# EAGLE design solr (EAGLE 8.2.1)
PROJECT_AUTHOR: tinkerman.cat <xose.perez@gmail.com>; PROJECT_LICENSE: CC-BY-SA 3.0; PROJECT_NAME: SOLR; PROJECT_VERSION: 2.1.20170611
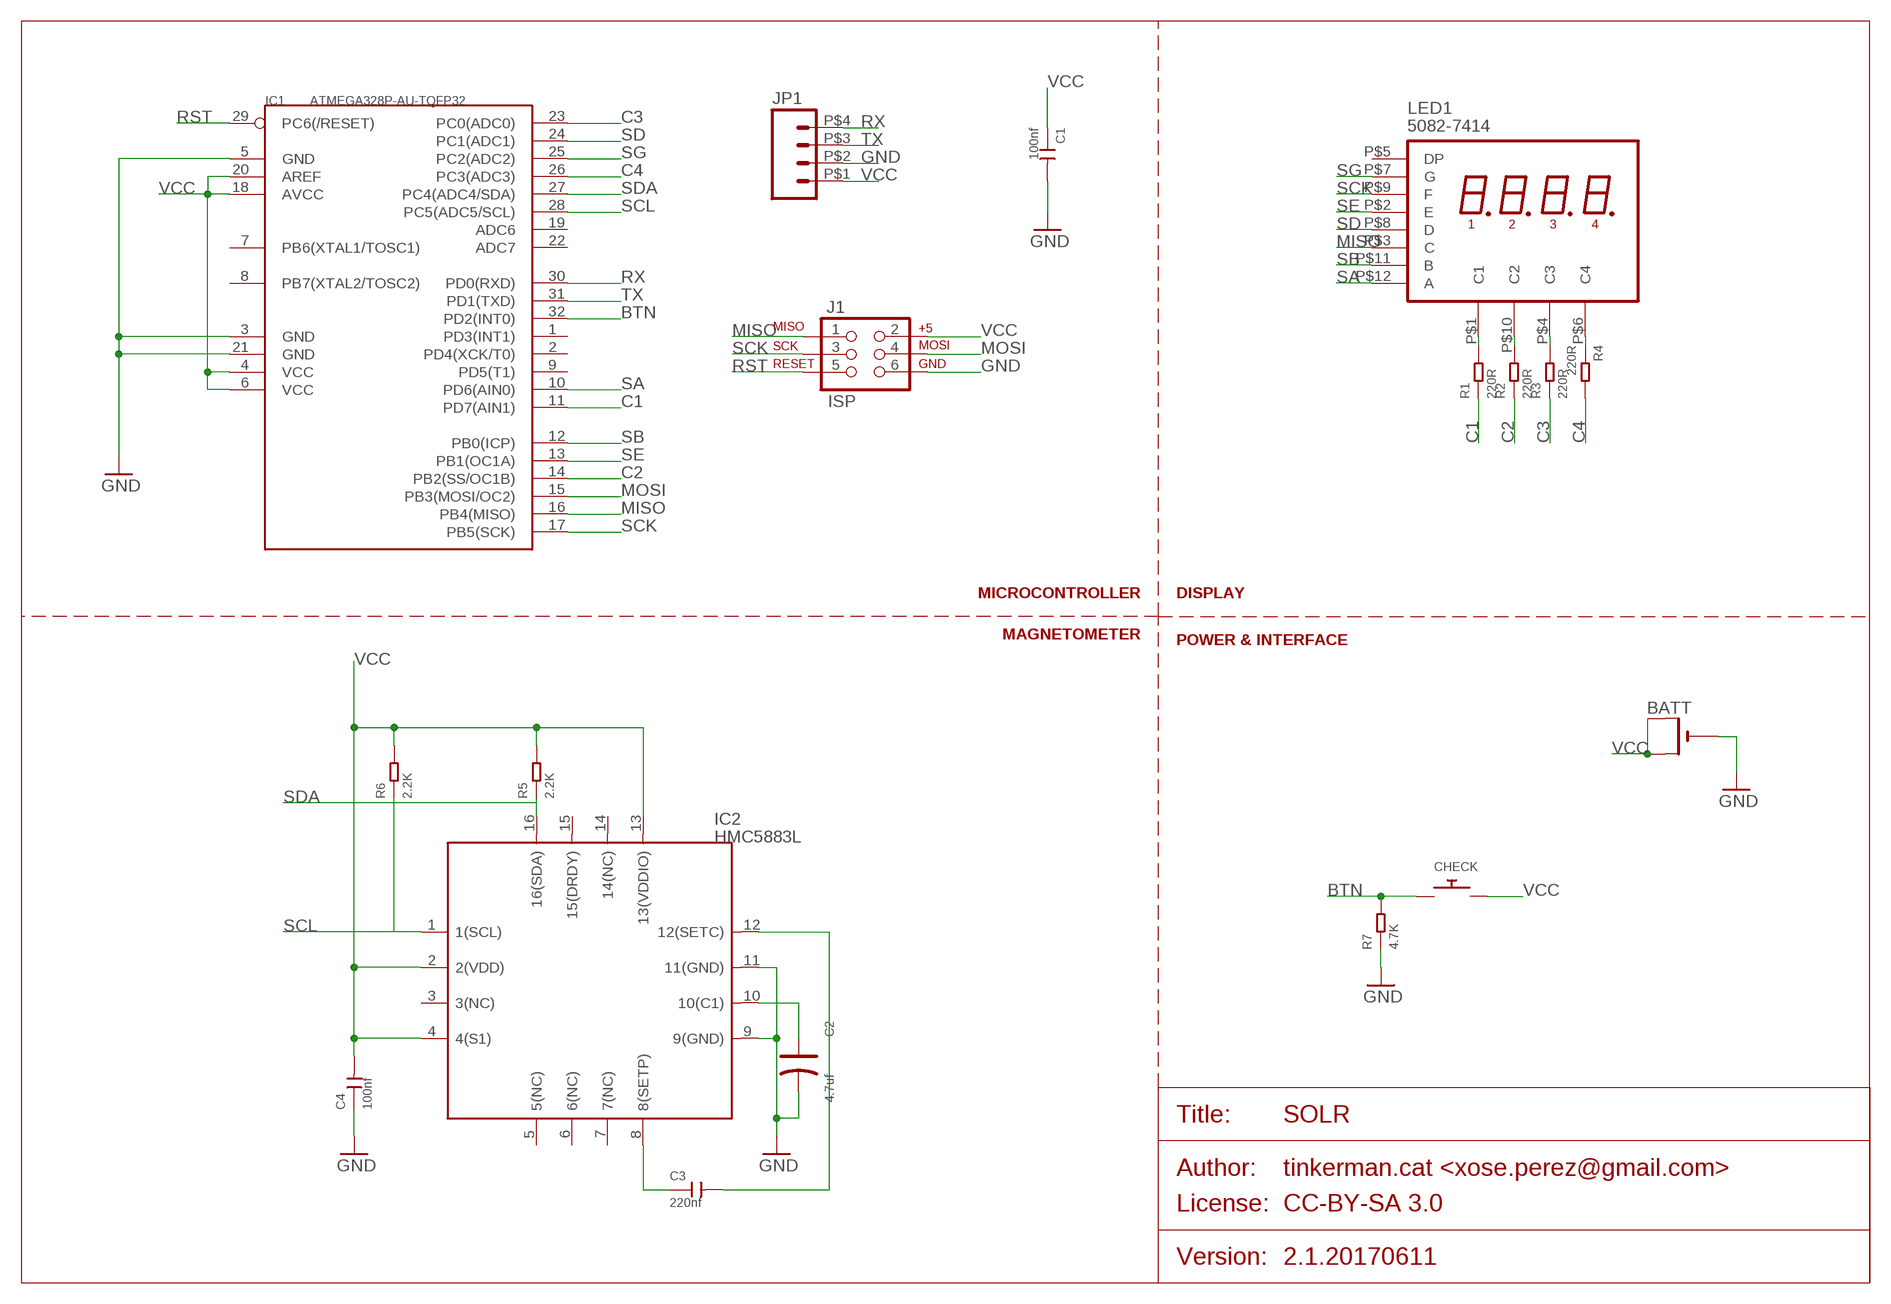
[diagram p0: schematic, sheet 1]

## Parts
BATT  CR2032SMT  [CR2032-SMD]
C1  100nf  CERAMIC-100NF-50V-10%-X7R(0805)  [C0805]
C2  4.7uf  TANTALUM-SMD-4.7UF-16V(AVX-A)  [AVX-A]
C3  220nf  CERAMIC-100NF-50V-10%-X7R(0805)  [C0805]
C4  100nf  CERAMIC-100NF-50V-10%-X7R(0805)  [C0805]
CHECK  SWITCH_PUSHBUTTONC&K_KSS  [BTN_CK_KSS]
IC1  ATMEGA328P-AU-TQFP32  MCU-ATMEGA328P-AU(TQFP32)  [TQFP32-0.8-7X7MM]
IC2  HMC5883L  MAGNETIC-HMC5883L(PLCC16)  [PLCC16-0.5-3X3MM]
J1  ISP  AVR_SPIEDGE  [2X3EDGE]
JP1  M04SMD_ROUND_PADS  [1X04_SMD_ROUND_PADS]
LED1  5082-7414  [5082-7414]
R1  220R  SMD-RES-220R-5%-1/8W(0805)  [R0805]
R2  220R  SMD-RES-220R-5%-1/8W(0805)  [R0805]
R3  220R  SMD-RES-220R-5%-1/8W(0805)  [R0805]
R4  220R  SMD-RES-220R-5%-1/8W(0805)  [R0805]
R5  2.2K  SMD-RES-2.2K-5%-1/8W(0805)  [R0805]
R6  2.2K  SMD-RES-2.2K-5%-1/8W(0805)  [R0805]
R7  4.7K  SMD-RES-4.7K-5%-1/8W(0805)  [R0805]

## Nets
BTN: CHECK.P$1 IC1.32(PD2(INT0)) R7.2
C1: IC1.11(PD7(AIN1)) R1.1
C2: IC1.14(PB2(SS/OC1B)) R2.1
C3: IC1.23(PC0(ADC0)) R3.1
C4: IC1.26(PC3(ADC3)) R4.2
GND: BATT.- C1.2 C2.- C4.1 IC1.3(GND) IC1.5(GND) IC1.21(GND) IC2.9(9(GND)) IC2.11(11(GND)) J1.6 JP1.P$2 R7.1
MISO: IC1.16(PB4(MISO)) J1.1 LED1.P$3(C)
MOSI: IC1.15(PB3(MOSI/OC2)) J1.4
N$1: LED1.P$1(C1) R1.2
N$2: C3.1 IC2.8(8(SETP))
N$3: LED1.P$10(C2) R2.2
N$4: LED1.P$4(C3) R3.2
N$5: LED1.P$6(C4) R4.1
N$7: C3.2 IC2.12(12(SETC))
N$10: C2.+ IC2.10(10(C1))
RST: IC1.29(PC6(/RESET)) J1.5
RX: IC1.30(PD0(RXD)) JP1.P$4
SA: IC1.10(PD6(AIN0)) LED1.P$12(A)
SB: IC1.12(PB0(ICP)) LED1.P$11(B)
SCK: IC1.17(PB5(SCK)) J1.3 LED1.P$9(F)
SCL: IC1.28(PC5(ADC5/SCL)) IC2.1(1(SCL)) R6.1
SD: IC1.24(PC1(ADC1)) LED1.P$8(D)
SDA: IC1.27(PC4(ADC4/SDA)) IC2.16(16(SDA)) R5.1
SE: IC1.13(PB1(OC1A)) LED1.P$2(E)
SG: IC1.25(PC2(ADC2)) LED1.P$7(G)
TX: IC1.31(PD1(TXD)) JP1.P$3
VCC: BATT.+$1(+) BATT.+$2(+1) C1.1 C4.2 CHECK.P$2 IC1.4(VCC) IC1.6(VCC) IC1.18(AVCC) IC1.20(AREF) IC2.2(2(VDD)) IC2.4(4(S1)) IC2.13(13(VDDIO)) J1.2 JP1.P$1 R5.2 R6.2
Unconnected: IC1.1(PD3(INT1)) IC1.2(PD4(XCK/T0)) IC1.7(PB6(XTAL1/TOSC1)) IC1.8(PB7(XTAL2/TOSC2)) IC1.9(PD5(T1)) IC1.19(ADC6) IC1.22(ADC7) IC2.3(3(NC)) IC2.5(5(NC)) IC2.6(6(NC)) IC2.7(7(NC)) IC2.14(14(NC)) IC2.15(15(DRDY)) LED1.P$5(DP)

## Notes on the sheet
- MICROCONTROLLER | DISPLAY
- MAGNETOMETER | POWER & INTERFACE

## Library data of the parts
BATT = xose:CR2032
C1 C4 = Seeed-Capacitor-2016:CERAMIC-100NF-50V-10%-X7R(0805): 302010165; MPN: CC0805KRX7R9BB104
C2 = Seeed-Capacitor-2016:TANTALUM-SMD-4.7UF-16V(AVX-A): 302020006; MPN: TAJA475*016#NJ
C3 = Seeed-Capacitor-2016:CERAMIC-100NF-50V-10%-X7R(0805): 302010165; MPN: CC0805KRX7R9BB104; VALUE: 100nf
CHECK = adafruit:SWITCH_PUSHBUTTON: Buttons SOFTTOUCHSMD_SJ - Soft touch temporary push button (Super Junk Akihabara) Compatible with SKPMANE010 [Mouser: 688-SKPMAN] C&K_KSS = Digikey: KSS221GLFS
IC1 = Seeed-IC-2016:MCU-ATMEGA328P-AU(TQFP32): 310010049; MPN: ATMEGA328P-AU
IC2 = Seeed-Sensor-2016:MAGNETIC-HMC5883L(PLCC16): 314040002; MPN: HMC5883L
J1 = xose:AVR_SPI: AVR ISP 6 Pin This is the reduced ISP connector for AVR programming. Common on Arduino. This footprint will take up less PCB space and can be used with a 10-pin to 6-pin adapter such as SKU: BOB-08508
JP1 = xose:M04: Header 4 Standard 4-pin 0.1" header. Use with straight break away headers (SKU : PRT-00116), right angle break away headers (PRT-00553), swiss pins (PRT-00743), machine pins (PRT-00117), and female headers (PRT-00115). Molex polarized connector foot print use with SKU : PRT-08231 with associated crimp pins and housings. 1MM SMD Version SKU: PRT-10208
LED1 = xose:5082-7414: 4 digits X 7-segment + DP LED display
R1-R4 = Seeed-Resistor-2016:SMD-RES-220R-5%-1/8W(0805): 301010315; MPN: RC0805JR-07220RL
R5 R6 = Seeed-Resistor-2016:SMD-RES-2.2K-5%-1/8W(0805): 301010333; MPN: RC0805JR-072K2L
R7 = Seeed-Resistor-2016:SMD-RES-4.7K-5%-1/8W(0805): 301010306; MPN: RC0805JR-074K7L

## Board
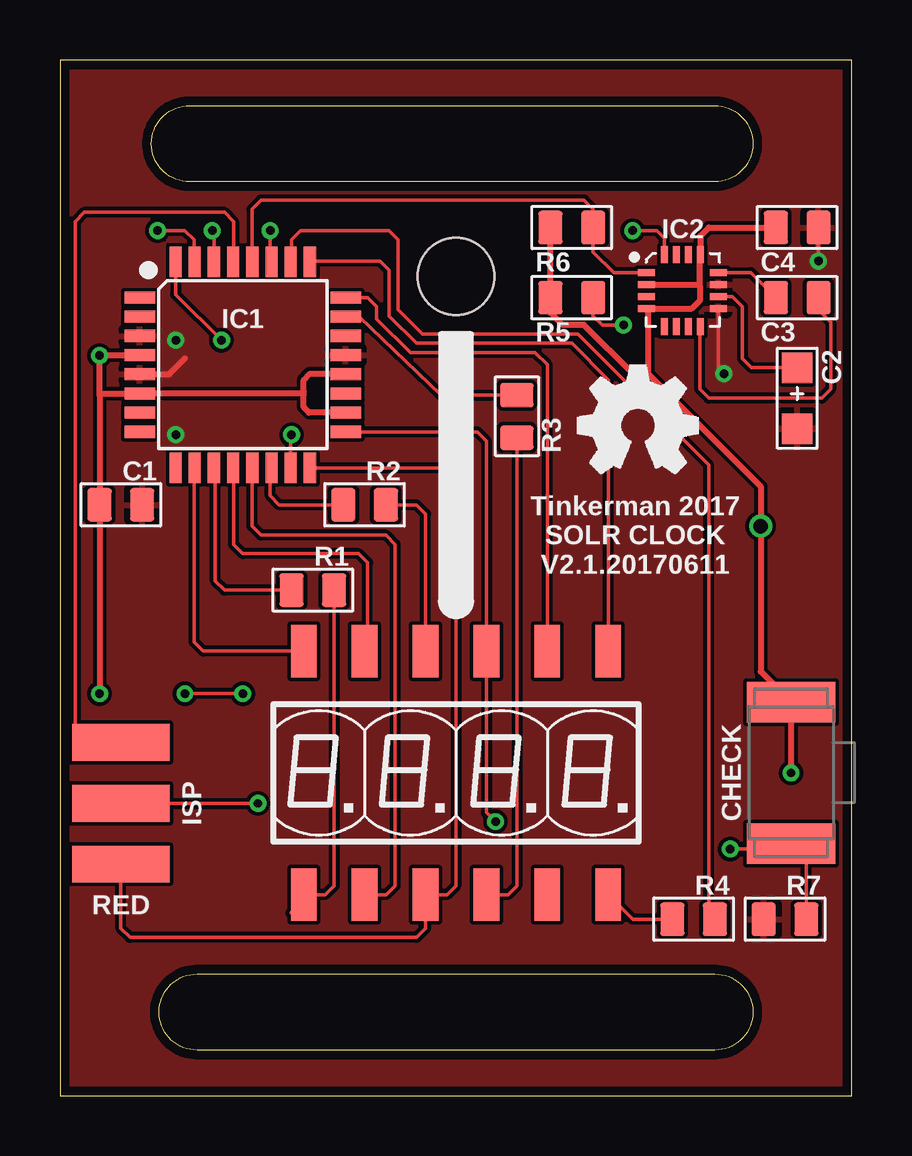
[diagram p1: board, top side]
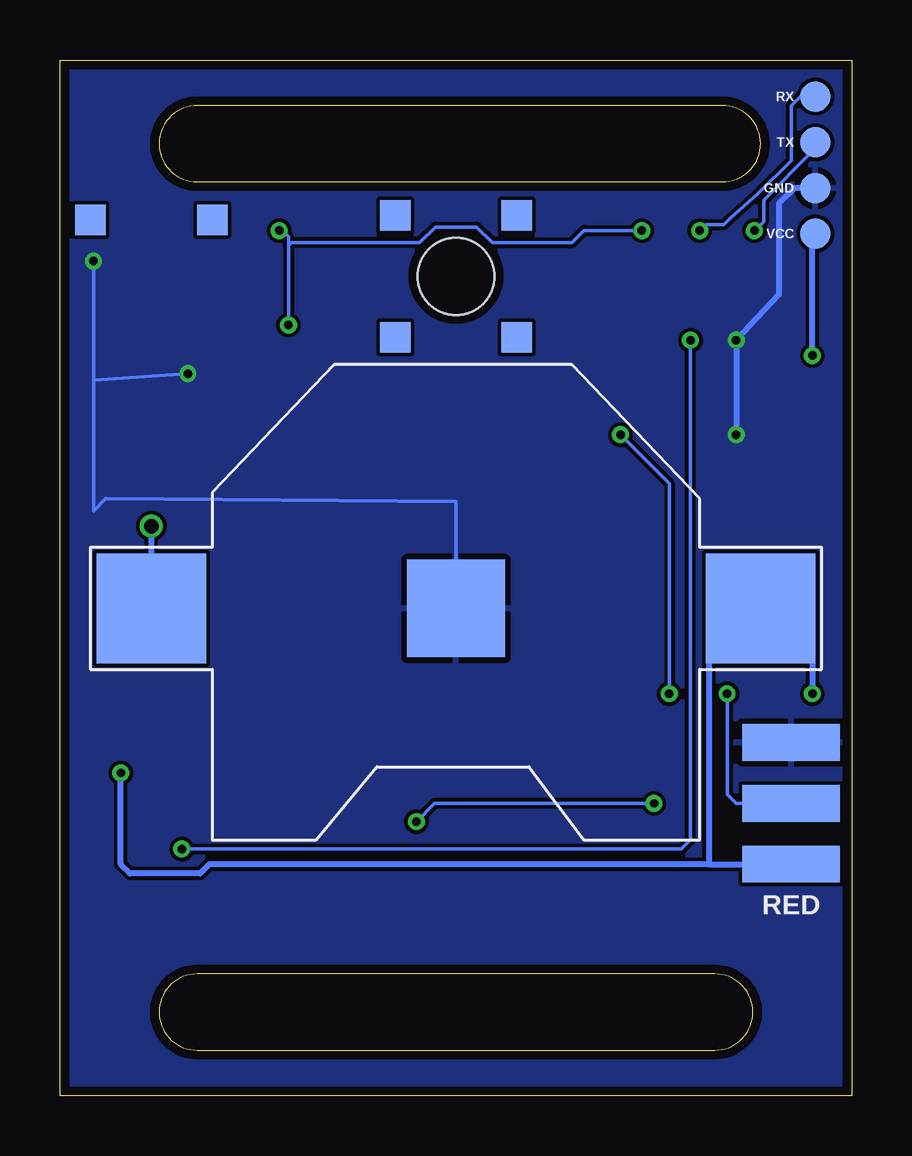
[diagram p2: board, bottom side, seen from below]

Size 33.02 x 43.18 mm. Coordinates in mm from the lower left corner, seen from the top.
Outline: 0,0 33.02,0 33.02,43.18 0,43.18 0,0
Outline: 5.4,41.27 27.3,41.27 arc-90 28.89,39.69 arc-90 27.3,38.1 5.4,38.1 arc-90 3.81,39.69 arc-90 5.4,41.27
Outline: 5.71,5.08 27.3,5.08 arc-90 28.89,3.49 arc-90 27.3,1.91 5.71,1.91 arc-90 4.13,3.49 arc-90 5.71,5.08
Copper layers (1*16): Top 0.0356mm / dielectric 1.5011mm / Bottom 0.0356mm
Design rules "oshpark-2layer": minimum track width 6mil, minimum drill 13mil, track to track 6mil, track to pad 6mil, pad to pad 6mil, via to via 6mil, smd to smd 6mil, copper to edge 15mil, drill to drill 6mil, minimum pad ring 7mil, minimum via ring 7mil, stop-mask expansion 2.5mil, vias tented up to drill 0mil, thermal gap 10mil
Holes 3.2 mm at 16.51,34.16

### Footprints (pad centres in the part's own frame; a part is rotated, then mirrored left to right if it is on the bottom)
CR2032-SMD = smd 4.572 x 4.572: +$1 -12.7,0; +$2 12.7,0 | smd 4.064 x 4.064: - 0,0
C0805 = smd 1.397 x 1.016: 1 0,0.889; 2 0,-0.889
AVX-A = smd 1.27 x 1.27: + -1.27,0; - 1.27,0
BTN_CK_KSS = smd 1.7 x 3.7: P$1 -2.95,0; P$2 2.95,0
TQFP32-0.8-7X7MM = smd 1.27 x 0.508: 1 -4.293,2.8; 2 -4.293,2; 3 -4.293,1.2; 4 -4.293,0.4; 5 -4.293,-0.4; 6 -4.293,-1.2; 7 -4.293,-2; 8 -4.293,-2.8; 17 4.293,-2.8; 18 4.293,-2; 19 4.293,-1.2; 20 4.293,-0.4; 21 4.293,0.4; 22 4.293,1.2; 23 4.293,2; 24 4.293,2.8 | smd 0.508 x 1.27: 9 -2.8,-4.293; 10 -2,-4.293; 11 -1.2,-4.293; 12 -0.4,-4.293; 13 0.4,-4.293; 14 1.2,-4.293; 15 2,-4.293; 16 2.8,-4.293; 25 2.8,4.293; 26 2,4.293; 27 1.2,4.293; 28 0.4,4.293; 29 -0.4,4.293; 30 -1.2,4.293; 31 -2,4.293; 32 -2.8,4.293
PLCC16-0.5-3X3MM = smd 0.7 x 0.3: 1 0,2.25; 2 0,1.75; 3 0,1.25; 4 0,0.75; 9 3,0.75; 10 3,1.25; 11 3,1.75; 12 3,2.25 | smd 0.3 x 0.7: 5 0.75,0; 6 1.25,0; 7 1.75,0; 8 2.25,0; 13 2.25,3; 14 1.75,3; 15 1.25,3; 16 0.75,3
2X3EDGE = smd 1.524 x 4.064: 1 2.54,0; 3 0,0; 5 -2.54,0 | smd 1.524 x 4.064 bottom: 2 2.54,0; 4 0,0; 6 -2.54,0
1X04_SMD_ROUND_PADS = smd 1.27 x 1.27: P$1 0,0; P$2 1.905,0; P$3 3.81,0; P$4 5.715,0
5082-7414 = smd 1.067 x 2.184: P$1 0,-1.27; P$2 2.54,-1.27; P$3 5.08,-1.27; P$4 7.62,-1.27; P$5 10.16,-1.27; P$6 12.7,-1.27; P$7 12.7,8.89; P$8 10.16,8.89; P$9 7.62,8.89; P$10 5.08,8.89; P$11 2.54,8.89; P$12 0,8.89
R0805 = smd 1.397 x 1.016: 1 0,0.889; 2 0,-0.889
M3_WELDING_NUT_FLAT = smd 1.27 x 1.27: P$1 -2.54,2.54; P$2 2.54,2.54; P$3 2.54,-2.54; P$4 -2.54,-2.54
M3_WELDING_NUT_STAND = smd 1.27 x 1.27: P$1 -2.54,0; P$2 2.54,0

### Placement (x,y rotation side)
BATT  16.51,20.32 180 bottom
C1  2.54,24.64 90 top
C2  30.73,29.08 270 top
C3  30.73,33.27 270 top
C4  30.73,36.2 270 top
CHECK  30.48,13.46 90 top
IC1  7.62,30.48 0 top
IC2  24.45,32.07 0 top
J1  2.54,12.19 270 top
JP1  1.52,35.94 90 bottom
LED1  10.16,9.65 0 top
R1  10.54,21.08 90 top
R2  12.7,24.64 90 top
R3  19.05,28.32 0 top
R4  26.42,7.37 90 top
R5  21.34,33.27 270 top
R6  21.34,36.2 270 top
R7  30.23,7.37 90 top
U$1  M3_WELDING_NUTFLAT  [M3_WELDING_NUT_FLAT]  16.51,34.16 0 bottom
U$2  M3_WELDING_NUTSTAND  [M3_WELDING_NUT_STAND]  29.21,36.51 0 bottom

### Tracks (layer width: path | path; a pad name or v marks a point on that pad's centre or on a via)
BTN  (via drill 0.35)
  Top 0.152: 30.38,10.29 v27.94,10.29 | v6.73,31.5 4.82,33.41 IC1.32 | R7.2 31.11,9.88 CHECK.P$1
  Top 0.191: CHECK.P$1 30.38,10.29
  Bottom 0.152: v27.94,10.29 7.11,10.29 6.73,10.67 v6.73,31.5
C1
  Top 0.152: R1.1 6.86,21.08 6.48,21.46 6.48,26.13 IC1.11
C2
  Top 0.152: R2.1 9.14,24.64 8.76,25.02 8.76,26.13 IC1.14
C3
  Top 0.152: IC1.23 12.48,32.48 15.88,29.21 R3.1
C4
  Top 0.152: 27.05,7.74 27.05,26.29 21.59,31.75 15.11,31.75 14.1,32.77 14.1,35.69 13.72,36.07 10.03,36.07 9.65,35.69 9.65,34.8 IC1.26
  Top 0.191: R4.2 27.05,7.74
GND  (via drill 0.35)
  Top 0.152: C4.1 v31.62,34.8 | IC2.9 27.45,30.21 v27.69,30.1
  Top 0.254: IC1.5 4.55,30.08 5.21,30.73
  Bottom 0.152: 31.62,29.84 v31.62,34.8 | 31.62,29.84 31.62,24.38 31.11,24.89 16.51,24.77 BATT.- | v27.69,30.1 31.62,29.84
  Bottom 0.254: JP1.P$2 2.41,37.85 3.05,37.21 3.05,33.4 v4.83,31.5 v4.83,27.56
  pour Top: 0,43.18 0,0 33.02,0 33.02,43.18
  pour Bottom: -0.38,43.43 33.4,43.43 33.4,-0.51 -0.38,-0.51
MISO
  Top 0.152: J1.1 2.54,6.99 2.92,6.6 14.86,6.6 15.24,6.99 LED1.P$3 16.13,8.38 16.51,8.76 16.51,25.78 16.13,26.16 10.45,26.16 IC1.16
MOSI  (via drill 0.35)
  Top 0.152: v7.62,16.76 v5.21,16.76 | IC1.15 9.62,27.15 v9.65,27.56
  Bottom 0.152: v9.65,27.56 7.62,25.53 v7.62,16.76 | v5.21,16.76 5.21,12.57 4.83,12.19 J1.4
N$1
  Top 0.152: R1.2 11.43,8.76 11.05,8.38 LED1.P$1
  Top 0.191: 9.65,7.62 10.16,8.13 LED1.P$1
N$2
  Top 0.152: IC2.8 26.67,32.04 26.67,29.46 27.05,29.08 31.75,29.08 32.13,29.46 32.13,32.26 31.62,32.77 C3.1
N$3
  Top 0.152: LED1.P$10 15.24,24.26 14.86,24.64 R2.2
N$4
  Top 0.152: LED1.P$4 18.67,8.38 19.05,8.76 R3.2
  Top 0.191: LED1.P$4 17.78,9.27
N$5
  Top 0.152: R4.1 23.88,7.37 LED1.P$6
N$7
  Top 0.152: IC2.12 28.8,34.32 C3.2
N$10
  Top 0.152: IC2.10 28.02,33.32 28.45,32.89 28.45,30.73 28.83,30.35 C2.+
RST
  Top 0.152: 2.6,14.61 0.64,14.67 0.64,36.45 1.02,36.83 6.86,36.83 7.24,36.45 7.24,34.79 IC1.29
  Top 0.191: 2.6,14.61 J1.5
RX  (via drill 0.35)
  Top 0.152: IC1.30 6.42,36 v6.35,36.07
  Bottom 0.152: v6.35,36.07 6.1,36.32 5.33,36.32 5.08,36.58 3.94,37.59 2.54,38.99 2.54,41.27 2.16,41.66 JP1.P$4
SA
  Top 0.152: LED1.P$12 5.97,18.54 5.59,18.92 5.59,26.16 IC1.10
SB
  Top 0.152: 12.83,18.54 12.83,22.23 12.45,22.61 7.62,22.61 7.24,22.99 7.24,26.17 IC1.12
  Top 0.191: LED1.P$11 12.83,18.54
SCK  (via drill 0.35)
  Top 0.152: J1.3 v8.26,12.19 | IC1.17 17.41,27.68 17.78,27.3 LED1.P$9 17.78,11.81 v18.16,11.43
  Top 0.191: J1.3 2.35,12.19
  Bottom 0.152: v8.26,12.19 17.4,12.19 v18.16,11.43
SCL
  Top 0.152: IC1.28 8,34.79 8,36.96 8.38,37.34 21.84,37.34 22.23,36.96 R6.1 22.23,35.18 23.09,34.32 IC2.1
SD
  Top 0.152: LED1.P$8 20.32,30.48 19.81,30.99 14.61,30.99 13.21,32.38 13.21,32.89 12.83,33.27 IC1.24
SDA  (via drill 0.35)
  Top 0.152: v8.76,36.07 8.76,34.83 IC1.27 | R5.1 22.23,32.51 22.61,32.13 v23.5,32.13 | IC2.16 25.2,35.76 24.89,36.07 v23.88,36.07
  Bottom 0.152: 23.5,35.43 v23.5,32.13 | 23.5,35.43 23.5,35.81 23.75,36.07 v23.88,36.07 | v8.76,36.07 11.18,36.07 11.68,35.56 15,35.56 15.66,36.22 17.36,36.22 18.02,35.56 23.37,35.56 23.5,35.43
SE
  Top 0.152: IC1.13 8,26.17 8,23.75 8.38,23.37 13.59,23.37 13.97,22.99 13.97,8.76 13.59,8.38 LED1.P$2
SG
  Top 0.152: LED1.P$7 22.86,29.84 21.34,31.37 14.86,31.37 13.72,32.51 13.72,34.42 13.34,34.8 10.45,34.8 IC1.25
TX  (via drill 0.35)
  Top 0.152: v4.06,36.07 5.21,36.07 5.59,35.69 5.59,34.8 IC1.31
  Bottom 0.152: v4.06,36.07 3.68,36.45 3.68,37.34 1.65,39.37 JP1.P$3
VCC  (via drill 0.35, 0.6)
  Top 0.254: 1.65,29.21 v1.65,30.86 1.67,30.88 IC1.4 | 1.65,29.21 C1.1 v1.65,16.76 | 11.88,28.45 IC1.18 10.38,28.48 10.16,28.7 10.16,29.22 10.1,29.28 | R6.2 R5.2 20.45,32.64 20.95,32.13 21.84,32.13 23.88,30.1 24.51,30.1 | 24.51,30.1 24.51,32.75 IC2.4 26.34,32.82 26.67,33.15 26.67,33.78 | 24.51,30.1 29.21,25.4 v29.21,23.75 29.21,17.68 CHECK.P$2 v30.48,13.46 | C4.2 27.05,36.2 26.7,35.84 IC2.13 26.67,34.97 26.67,33.78 | IC2.2 26.63,33.82 26.67,33.78 | 1.65,29.21 1.72,29.28 IC1.6 10.1,29.28 | 10.1,29.28 10.16,29.34 10.16,29.84 10.41,30.1 11.89,30.1 IC1.20
  Bottom 0.152: 3.81,20.44 BATT.+$1
  Bottom 0.254: 5.97,9.65 5.97,20.32 3.24,19.35 3.24,19.75 BATT.+$1 1.65,18.16 v1.65,16.76 | 5.97,9.65 J1.2 | v1.65,30.86 1.65,35.81 JP1.P$1 | 5.97,9.65 26.8,9.65 27.18,9.27 30.1,9.27 30.48,9.65 v30.48,13.46 | v29.21,23.75 BATT.+$2

### Text on the board
tPlace: Tinkerman 2017 / SOLR CLOCK / V2.1.20170611
bPlace: RX | TX | GND | VCC